# EAGLE design V1 (EAGLE 9.6.2)
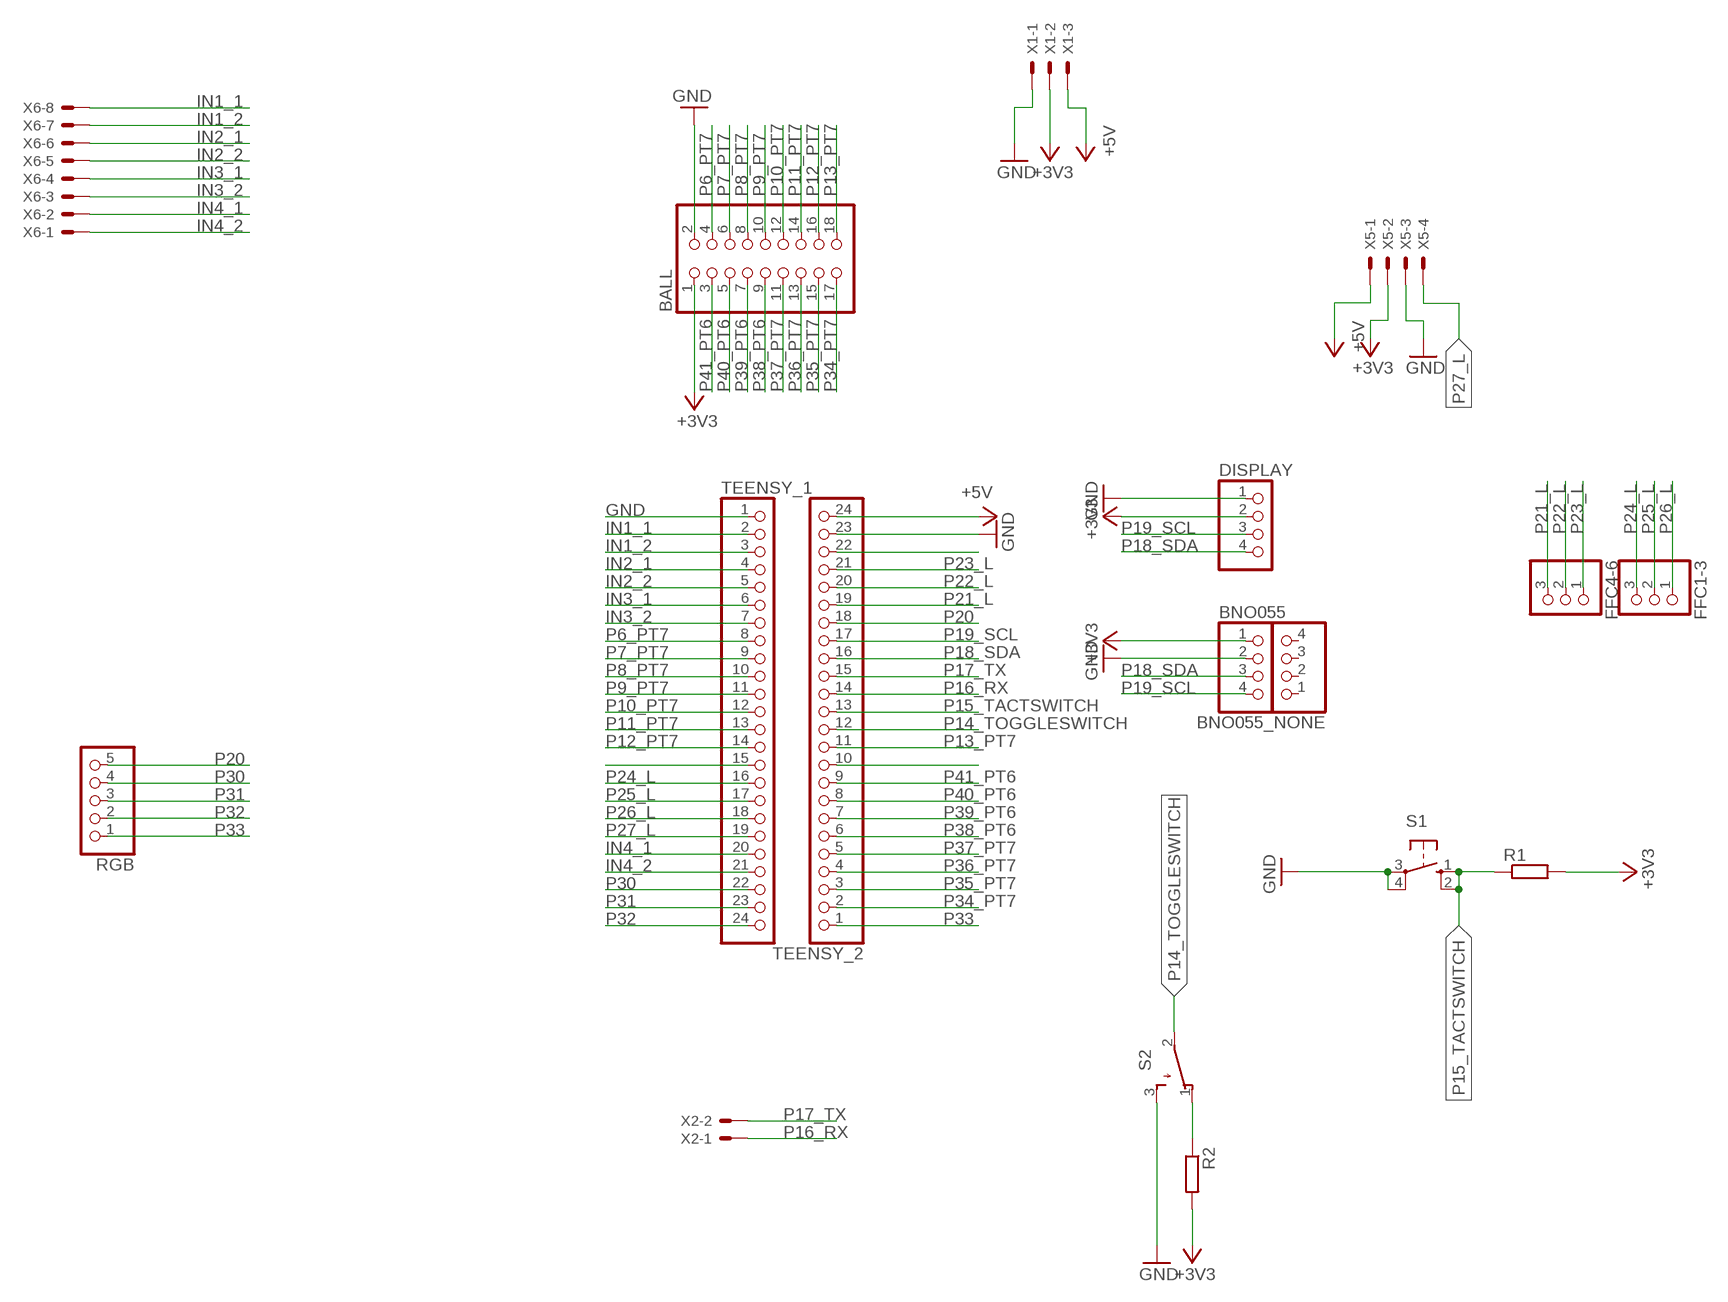
[diagram p0: schematic, sheet 1]

## Parts
BALL  PINHD-2X9  [2X09]
BNO055  PINHD-1X4  [1X04]
BNO055_NONE  PINHD-1X4  [1X04]
DISPLAY  PINHD-1X04_2.54-S  [1X04-S]
FFC1-3  PINHD-1X03_2.54-S  [1X03-S]
FFC4-6  PINHD-1X03_2.54-S  [1X03-S]
R1  R-EU_0207/10  [0207/10]
R2  R-EU_0207/10  [0207/10]
RGB  PINHD-1X05_2.54-S  [1X05-S]
S1  40-XX  [B3F-40XX]
S2  TL32PO  [TL3XPO]
TEENSY_1  PINHD-1X24  [1X24]
TEENSY_2  PINHD-1X24  [1X24]
X1  JST-XH-03-PIN-ROUND-PAD  [JST-XH-03-PACKAGE-ROUND-PAD]
X2  JST-XH-02-PIN-ROUND-PAD  [JST-XH-02-PACKAGE-ROUND-PAD]
X5  JST-XH-04-PIN-ROUND-PAD  [JST-XH-04-PACKAGE-ROUND-PAD]
X6  JST-XH-08-PIN-ROUND-PAD  [JST-XH-08-PACKAGE-ROUND-PAD]

## Nets
+3V3: BALL.1 BNO055.1 DISPLAY.2 R1.2 R2.2 X1.2 X5.2
+5V: TEENSY_2.24 X1.3 X5.1
GND: BALL.2 BNO055.2 DISPLAY.1 S1.3(P) S1.4(P1) S2.3(S) TEENSY_1.1 TEENSY_2.23 X1.1 X5.3
IN1_1: TEENSY_1.2 X6.8
IN1_2: TEENSY_1.3 X6.7
IN2_1: TEENSY_1.4 X6.6
IN2_2: TEENSY_1.5 X6.5
IN3_1: TEENSY_1.6 X6.4
IN3_2: TEENSY_1.7 X6.3
IN4_1: TEENSY_1.20 X6.2
IN4_2: TEENSY_1.21 X6.1
N$3: TEENSY_2.22
N$8: R2.1 S2.1(O)
N$16: TEENSY_2.10
N$35: TEENSY_1.15
P6_PT7: BALL.4 TEENSY_1.8
P7_PT7: BALL.6 TEENSY_1.9
P8_PT7: BALL.8 TEENSY_1.10
P9_PT7: BALL.10 TEENSY_1.11
P10_PT7: BALL.12 TEENSY_1.12
P11_PT7: BALL.14 TEENSY_1.13
P12_PT7: BALL.16 TEENSY_1.14
P13_PT7: BALL.18 TEENSY_2.11
P14_TOGGLESWITCH: S2.2(P) TEENSY_2.12
P15_TACTSWITCH: R1.1 S1.1(S) S1.2(S1) TEENSY_2.13
P16_RX: TEENSY_2.14 X2.1
P17_TX: TEENSY_2.15 X2.2
P18_SDA: BNO055.3 DISPLAY.4 TEENSY_2.16
P19_SCL: BNO055.4 DISPLAY.3 TEENSY_2.17
P20: RGB.5 TEENSY_2.18
P21_L: FFC4-6.3 TEENSY_2.19
P22_L: FFC4-6.2 TEENSY_2.20
P23_L: FFC4-6.1 TEENSY_2.21
P24_L: FFC1-3.3 TEENSY_1.16
P25_L: FFC1-3.2 TEENSY_1.17
P26_L: FFC1-3.1 TEENSY_1.18
P27_L: TEENSY_1.19 X5.4
P30: RGB.4 TEENSY_1.22
P31: RGB.3 TEENSY_1.23
P32: RGB.2 TEENSY_1.24
P33: RGB.1 TEENSY_2.1
P34_PT7: BALL.17 TEENSY_2.2
P35_PT7: BALL.15 TEENSY_2.3
P36_PT7: BALL.13 TEENSY_2.4
P37_PT7: BALL.11 TEENSY_2.5
P38_PT6: BALL.9 TEENSY_2.6
P39_PT6: BALL.7 TEENSY_2.7
P40_PT6: BALL.5 TEENSY_2.8
P41_PT6: BALL.3 TEENSY_2.9
Unconnected: BNO055_NONE.1 BNO055_NONE.2 BNO055_NONE.3 BNO055_NONE.4

## Library data of the parts
BALL = pinhead:PINHD-2X9: PIN HEADER
BNO055 BNO055_NONE = pinhead:PINHD-1X4: PIN HEADER
DISPLAY = pinhead-2:PINHD-1X04: PIN HEADER
FFC1-3 FFC4-6 = pinhead-2:PINHD-1X03: PIN HEADER
R1 R2 = rcl:R-EU_: RESISTOR, European symbol; SPICEPREFIX: R
RGB = pinhead-2:PINHD-1X05: PIN HEADER
S1 = switch-omron:40-XX: OMRON SWITCH; MF: OMRON COMPONENTS USA; MPN: B3F-4000; OC_FARNELL: 176434; OC_NEWARK: 36K3105
S2 = switch:TL32PO: TINY SWITCH ON - MOM Source: http://www2.produktinfo.conrad.com/datenblaetter/700000-724999/705152-da-01-de-Subminiaturschalter_TL_36YO.pdf
TEENSY_1 TEENSY_2 = pinhead:PINHD-1X24: PIN HEADER
X1 = Rembrandt Electronics - JST XH Connectors v1-0:JST-XH-03-PIN: JST XH Connector 2 Pin Wire to board connector. Pitch: 2,54 mm, (0.100") Number of pins: 3 Created by Rembrandt Electronics www.rembrandtelectronics.com
X2 = Rembrandt Electronics - JST XH Connectors v1-0:JST-XH-02-PIN: JST XH Connector 2 Pin Wire to board connector. Pitch: 2,54 mm, (0.100") Number of pins: 2 Created by Rembrandt Electronics www.rembrandtelectronics.com
X5 = Rembrandt Electronics - JST XH Connectors v1-0:JST-XH-04-PIN: JST XH Connector 2 Pin Wire to board connector. Pitch: 2,54 mm, (0.100") Number of pins: 4 Created by Rembrandt Electronics www.rembrandtelectronics.com
X6 = Rembrandt Electronics - JST XH Connectors v1-0:JST-XH-08-PIN: JST XH Connector 2 Pin Wire to board connector. Pitch: 2,54 mm, (0.100") Number of pins: 8 Created by Rembrandt Electronics www.rembrandtelectronics.com

## Net classes
0 default: clearance 1 mm

## Board
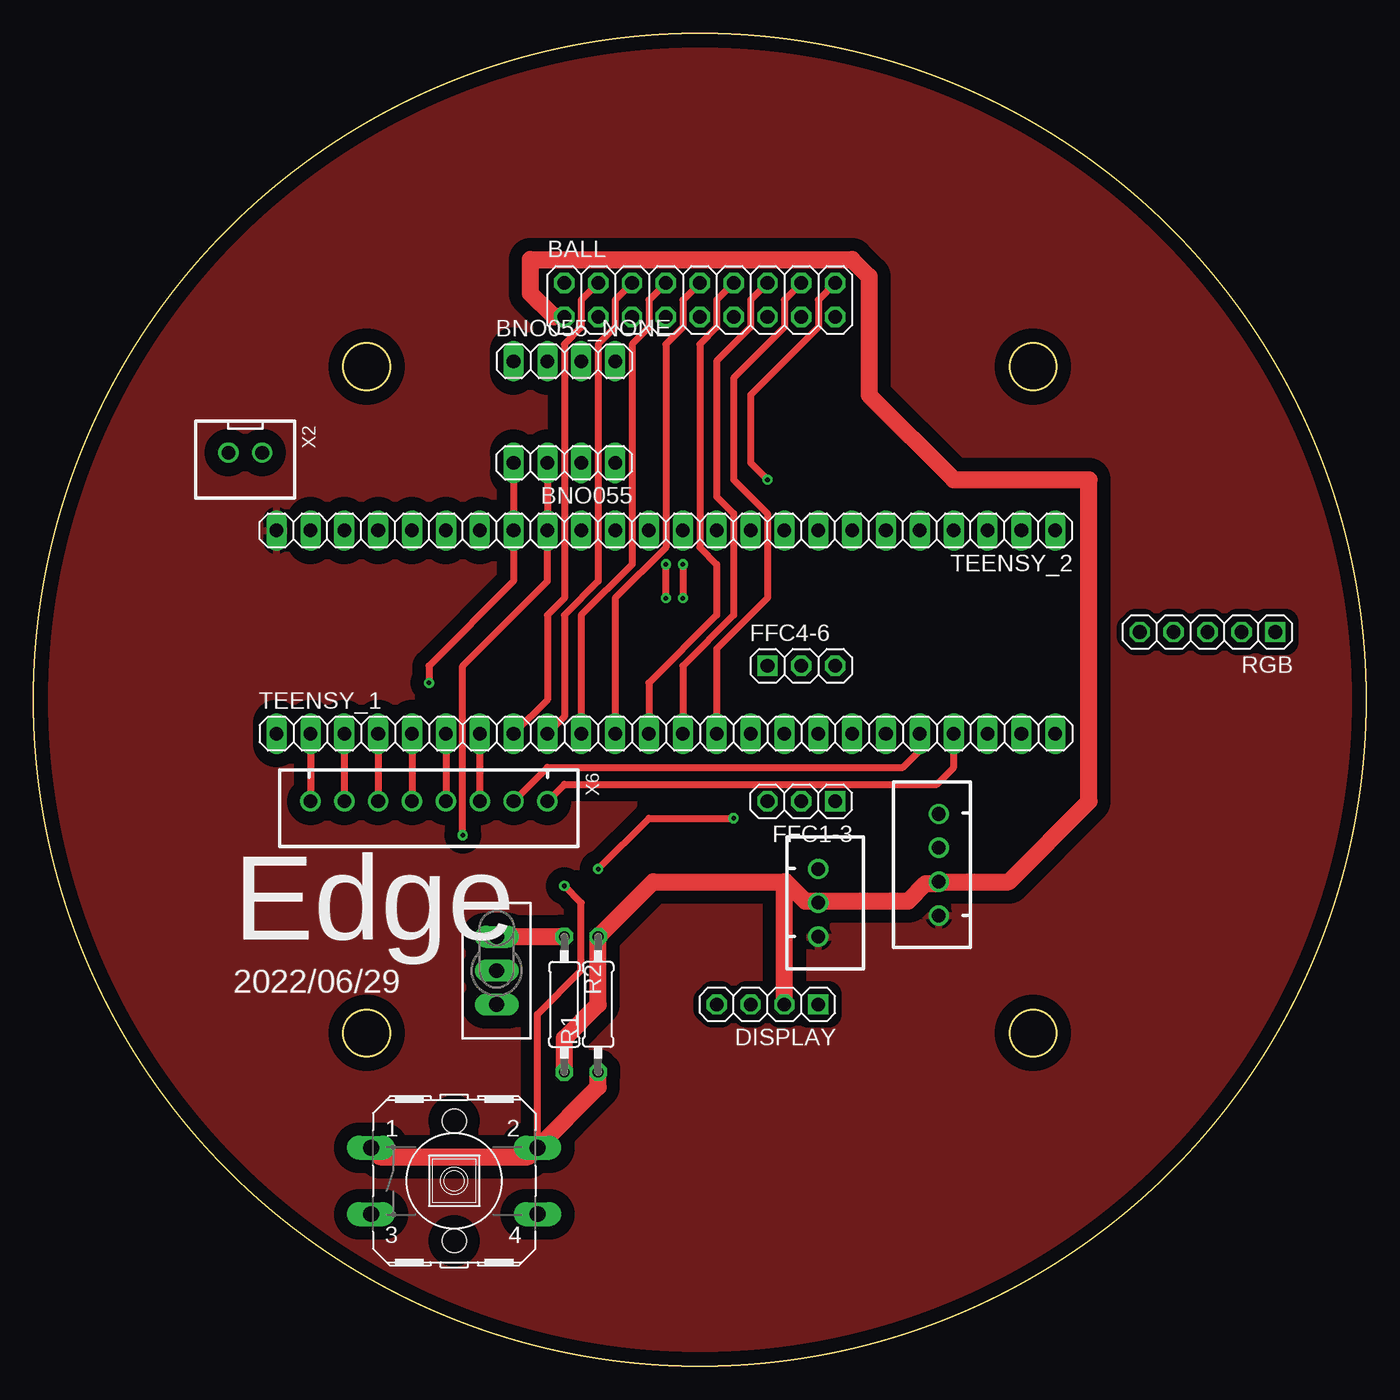
[diagram p1: board, top side]
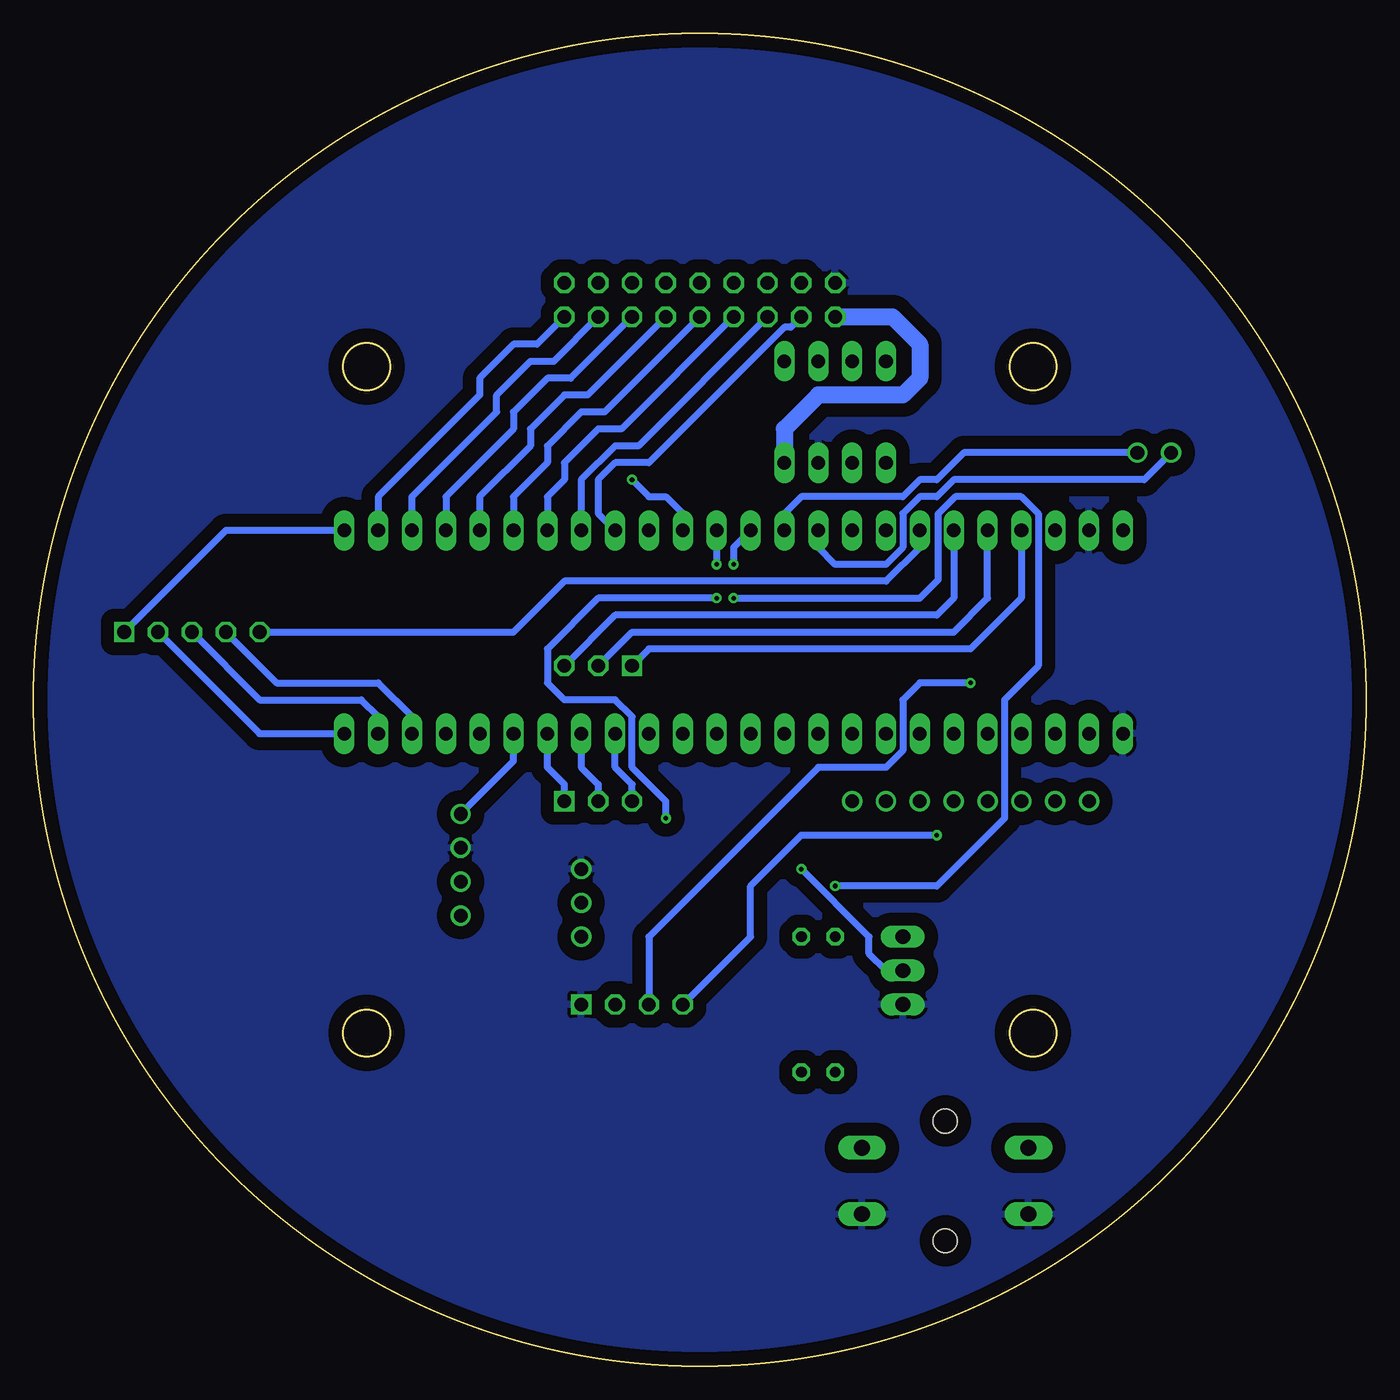
[diagram p2: board, bottom side, seen from below]

Size 100 x 100 mm. Coordinates in mm from the lower left corner, seen from the top.
Outline: circle at 50,50 radius 50
Outline: circle at 75,75 radius 1.75
Outline: circle at 25,75 radius 1.75
Outline: circle at 25,25 radius 1.75
Outline: circle at 75,25 radius 1.75
Copper layers (1*16): Top 0.035mm / dielectric 1.5mm / Bottom 0.035mm
Design rules "default": minimum track width 6mil, minimum drill 0.35mm, track to track 6mil, track to pad 6mil, pad to pad 6mil, via to via 6mil, smd to smd 6mil, copper to edge 40mil, drill to drill 6mil, minimum pad ring 10mil, minimum via ring 8mil, stop-mask expansion 4mil, vias tented up to drill 0mil, thermal gap 10mil

### Footprints (pad centres in the part's own frame; a part is rotated, then mirrored left to right if it is on the bottom)
2X09 = drill 1.016 octagon: 1 -10.16,-1.27; 2 -10.16,1.27; 3 -7.62,-1.27; 4 -7.62,1.27; 5 -5.08,-1.27; 6 -5.08,1.27; 7 -2.54,-1.27; 8 -2.54,1.27; 9 0,-1.27; 10 0,1.27; 11 2.54,-1.27; 12 2.54,1.27; 13 5.08,-1.27; 14 5.08,1.27; 15 7.62,-1.27; 16 7.62,1.27; 17 10.16,-1.27; 18 10.16,1.27
1X04 = drill 1.016 long: 1 -3.81,0; 2 -1.27,0; 3 1.27,0; 4 3.81,0
1X04-S = drill 1.016 square: 1 -3.81,0 | drill 1.016 octagon: 2 -1.27,0; 3 1.27,0; 4 3.81,0
1X03-S = drill 1.016 square: 1 -2.54,0 | drill 1.016 octagon: 2 0,0; 3 2.54,0
0207/10 = drill 0.813 octagon: 1 -5.08,0; 2 5.08,0
1X05-S = drill 1.016 square: 1 -5.08,0 | drill 1.016 octagon: 2 -2.54,0; 3 0,0; 4 2.54,0; 5 5.08,0
B3F-40XX = drill 1.194 long: 1 -6.248,2.489; 2 6.248,2.489; 3 -6.248,-2.489; 4 6.248,-2.489 | hole 1.803: 0,-4.496; 0,4.496
TL3XPO = drill 1.1 pad 1.422 long: 1 -2.54,0; 2 0,0; 3 2.54,0
1X24 = drill 1.016 long: 1 -29.21,0; 2 -26.67,0; 3 -24.13,0; 4 -21.59,0; 5 -19.05,0; 6 -16.51,0; 7 -13.97,0; 8 -11.43,0; 9 -8.89,0; 10 -6.35,0; 11 -3.81,0; 12 -1.27,0; 13 1.27,0; 14 3.81,0; 15 6.35,0; 16 8.89,0; 17 11.43,0; 18 13.97,0; 19 16.51,0; 20 19.05,0; 21 21.59,0; 22 24.13,0; 23 26.67,0; 24 29.21,0
JST-XH-03-PACKAGE-ROUND-PAD = drill 1.016: 1 -2.54,0; 2 0,0; 3 2.54,0
JST-XH-02-PACKAGE-ROUND-PAD = drill 1.016: 1 -1.27,0; 2 1.27,0
JST-XH-04-PACKAGE-ROUND-PAD = drill 1.016: 1 -3.81,0; 2 -1.27,0; 3 1.27,0; 4 3.81,0
JST-XH-08-PACKAGE-ROUND-PAD = drill 1.016: 1 -8.89,0; 2 -6.35,0; 3 -3.81,0; 4 -1.27,0; 5 1.27,0; 6 3.81,0; 7 6.35,0; 8 8.89,0

### Placement (x,y rotation side)
BALL  50,80 0 top
BNO055  39.84,67.78 180 top
BNO055_NONE  39.84,75.4 0 top
DISPLAY  55.08,27.14 180 top
FFC1-3  57.62,42.38 180 top
FFC4-6  57.62,52.54 0 top
R1  42.38,27.14 90 top
R2  39.84,27.14 270 top
RGB  88.1,55.08 180 top
S1  31.58,13.9 0 top
S2  34.76,29.68 270 top
TEENSY_1  47.46,47.46 0 top
TEENSY_2  47.46,62.7 180 top
X1  58.89,34.76 270 top
X2  15.9,68.54 180 top
X5  67.94,37.62 90 top
X6  29.68,42.38 180 top

### Tracks (layer width: path | path; a pad name or v marks a point on that pad's centre or on a via)
+3V3
  Top 1.27: 56.35,36.35 46.51,36.35 R1.2 42.38,27.14 39.84,24.6 R2.2 | DISPLAY.2 56.35,36.35 | BALL.1 39.05,78.73 37.3,80.48 37.3,83.02 61.43,83.02 62.7,81.75 62.7,72.86 69.05,66.51 79.21,66.51 79.21,42.38 73.18,36.35 X5.2 67.8,36.21 66.95,36.21 65.64,34.9 59.03,34.9 X1.2 58.75,34.9 57.9,34.9 56.45,36.35 56.35,36.35
  Bottom 1.27: BALL.1 35.55,78.73 33.49,76.67 33.49,74.13 34.76,72.86 41.11,72.86 43.65,70.32 BNO055.1
+5V
  pour Top: 32.22,100.8 69.05,100.8 100.8,69.05 100.8,29.68 71.59,0.47 28.41,0.47 0.47,28.41 0.47,71.59 14.44,85.56 29.68,100.8
GND
  pour Bottom: 30.95,99.53 32.22,100.8 69.05,100.8 100.8,69.05 100.8,29.68 71.59,0.47 28.41,0.47 -0.8,29.68 -0.8,69.05 29.68,99.53
IN1_1
  Top 0.508: TEENSY_1.2 X6.8
IN1_2
  Top 0.508: TEENSY_1.3 X6.7
IN2_1
  Top 0.508: TEENSY_1.4 X6.6
IN2_2
  Top 0.508: TEENSY_1.5 X6.5
IN3_1
  Top 0.508: TEENSY_1.6 X6.4
IN3_2
  Top 0.508: TEENSY_1.7 X6.3
IN4_1
  Top 0.508: X6.2 38.57,44.92 65.24,44.92 66.51,46.19 TEENSY_1.20
IN4_2
  Top 0.508: X6.1 39.84,43.65 67.78,43.65 69.05,44.92 TEENSY_1.21
N$8
  Top 1.27: R2.1 S2.1
P6_PT7
  Top 0.508: BALL.4 41.11,80 41.11,77.94 39.84,76.67 39.84,57.62 38.57,56.35 38.57,50 TEENSY_1.8
P7_PT7
  Top 0.508: BALL.6 43.65,80 43.65,77.94 42.38,76.67 42.38,58.89 39.84,56.35 39.84,48.73 TEENSY_1.9
P8_PT7
  Top 0.508: BALL.8 46.19,80 46.19,77.94 44.92,76.67 44.92,60.16 41.11,56.35 TEENSY_1.10
P9_PT7
  Top 0.508: BALL.10 48.73,80 48.73,77.94 47.46,76.67 47.46,61.43 43.65,57.62 43.65,56.35 TEENSY_1.11
P10_PT7
  Top 0.508: BALL.12 51.27,80 51.27,77.94 50,76.67 50,61.43 51.27,60.16 51.27,56.35 46.19,51.27 TEENSY_1.12
P11_PT7
  Top 0.508: BALL.14 53.81,80 53.81,77.94 51.27,75.4 51.27,65.24 52.54,63.97 52.54,56.35 48.73,52.54 TEENSY_1.13
P12_PT7
  Top 0.508: BALL.16 56.35,80 56.35,77.94 52.54,74.13 52.54,66.51 55.08,63.97 55.08,57.62 51.27,53.81 TEENSY_1.14
P13_PT7  (via drill 0.35)
  Top 0.508: BALL.18 58.89,80 58.89,77.94 53.81,72.86 53.81,67.78 v55.08,66.51
  Bottom 0.508: v55.08,66.51 53.81,65.24 52.54,65.24 51.27,63.97 TEENSY_2.11
P14_TOGGLESWITCH  (via drill 0.35)
  Top 0.508: v42.38,37.3 46.19,41.11 v52.54,41.11 | v48.73,60.16 v48.73,57.62
  Bottom 0.508: S2.2 36.03,29.68 37.3,30.95 37.3,32.22 v42.38,37.3 | v52.54,41.11 52.54,42.38 55.08,44.92 55.08,48.73 56.35,50 60.16,50 61.43,51.27 61.43,53.81 57.62,57.62 v48.73,57.62 | TEENSY_2.12 v48.73,60.16
P15_TACTSWITCH  (via drill 0.35)
  Top 0.508: S1.2 37.83,26.4 41.11,29.68 41.11,34.76 v39.84,36.03 | v47.46,57.62 v47.46,60.16
  Top 1.27: S1.1 26.01,15.71 37.15,15.71 S1.2 42.38,20.94 R1.1
  Bottom 0.508: v39.84,36.03 32.22,36.03 27.14,41.11 27.14,50 24.6,52.54 24.6,63.97 25.87,65.24 30.82,65.24 32.12,63.95 32.12,58.99 33.49,57.62 v47.46,57.62 | TEENSY_2.13 47.46,61.43 v47.46,60.16
P16_RX
  Bottom 0.508: X2.1 30.19,68.54 32.22,66.51 33.49,66.51 34.76,65.24 42.38,65.24 43.65,63.97 TEENSY_2.14
P17_TX
  Bottom 0.508: X2.2 16.66,66.51 30.95,66.51 32.22,65.24 33.49,65.24 34.76,63.97 34.76,61.43 36.03,60.16 39.84,60.16 41.11,61.43 TEENSY_2.15
P18_SDA  (via drill 0.35)
  Top 0.508: BNO055.3 TEENSY_2.16 38.57,58.89 32.22,52.54 v32.22,39.84
  Bottom 0.508: DISPLAY.4 46.19,32.22 46.19,36.03 42.38,39.84 v32.22,39.84
P19_SCL  (via drill 0.35)
  Top 0.508: BNO055.4 TEENSY_2.17 36.03,58.89 29.68,52.54 v29.68,51.27
  Bottom 0.508: DISPLAY.3 53.81,32.22 41.11,44.92 36.03,44.92 34.76,46.19 34.76,50 33.49,51.27 v29.68,51.27
P20
  Bottom 0.508: RGB.5 63.97,55.08 60.16,58.89 36.03,58.89 33.49,61.43 TEENSY_2.18
P21_L
  Bottom 0.508: TEENSY_2.19 30.95,57.62 32.22,56.35 56.35,56.35 FFC4-6.3
P22_L
  Bottom 0.508: FFC4-6.2 55.08,55.08 30.95,55.08 28.41,57.62 TEENSY_2.20
P23_L
  Bottom 0.508: TEENSY_2.21 25.87,57.62 29.68,53.81 53.81,53.81 FFC4-6.1
P24_L
  Bottom 0.508: FFC1-3.3 55.08,43.65 56.35,44.92 TEENSY_1.16
P25_L
  Bottom 0.508: TEENSY_1.17 58.89,44.92 57.62,43.65 FFC1-3.2
P26_L
  Bottom 0.508: FFC1-3.1 60.16,43.65 61.43,44.92 TEENSY_1.18
P27_L
  Bottom 0.508: X5.4 63.97,45.4 TEENSY_1.19
P30
  Bottom 0.508: TEENSY_1.22 71.59,48.73 74.13,51.27 81.75,51.27 RGB.4
P31
  Bottom 0.508: TEENSY_1.23 74.13,48.73 75.4,50 83.02,50 RGB.3
P32
  Bottom 0.508: RGB.2 83.02,47.46 TEENSY_1.24
P33
  Bottom 0.508: TEENSY_2.1 85.56,62.7 RGB.1
P34_PT7
  Bottom 0.508: BALL.17 62.22,76.67 63.97,76.67 66.51,74.13 66.51,72.86 74.13,65.24 TEENSY_2.2
P35_PT7
  Bottom 0.508: TEENSY_2.3 71.59,65.24 65.24,71.59 65.24,72.86 62.7,75.4 60.95,75.4 BALL.15
P36_PT7
  Bottom 0.508: BALL.13 59.68,74.13 61.43,74.13 63.97,71.59 63.97,70.32 69.05,65.24 TEENSY_2.4
P37_PT7
  Bottom 0.508: BALL.11 58.41,72.86 60.16,72.86 62.7,70.32 62.7,69.05 66.51,65.24 TEENSY_2.5
P38_PT6
  Bottom 0.508: BALL.9 57.14,71.59 58.89,71.59 61.43,69.05 61.43,67.78 63.97,65.24 TEENSY_2.6
P39_PT6
  Bottom 0.508: BALL.7 55.87,70.32 57.62,70.32 60.16,67.78 60.16,66.51 61.43,65.24 TEENSY_2.7
P40_PT6
  Bottom 0.508: BALL.5 54.6,69.05 56.35,69.05 58.89,66.51 TEENSY_2.8
P41_PT6
  Bottom 0.508: BALL.3 43.17,77.94 43.65,77.94 53.81,67.78 56.35,67.78 57.62,66.51 57.62,63.97 TEENSY_2.9

### Text on the board
tNames: Edge | 2022/06/29